# Altium schematic sheet Top Level.SchDoc: Top Level
size A4; SheetNumber: 2; SheetTotal: 6
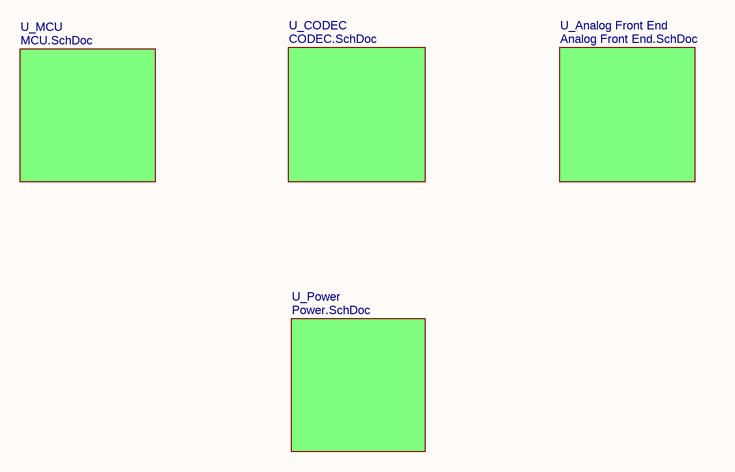
[diagram p0: Top Level.SchDoc]

## Sub-sheets
U_Analog Front End = Analog Front End.SchDoc: no entries
U_CODEC = CODEC.SchDoc: no entries
U_MCU = MCU.SchDoc: no entries
U_Power = Power.SchDoc: no entries

## Notes on the sheet
- TITLE
- DRAWN BY
- DATE
- PROJECT
- FILE
- SHEET SIZE
- A4
- REVISION
- PAGE
- of